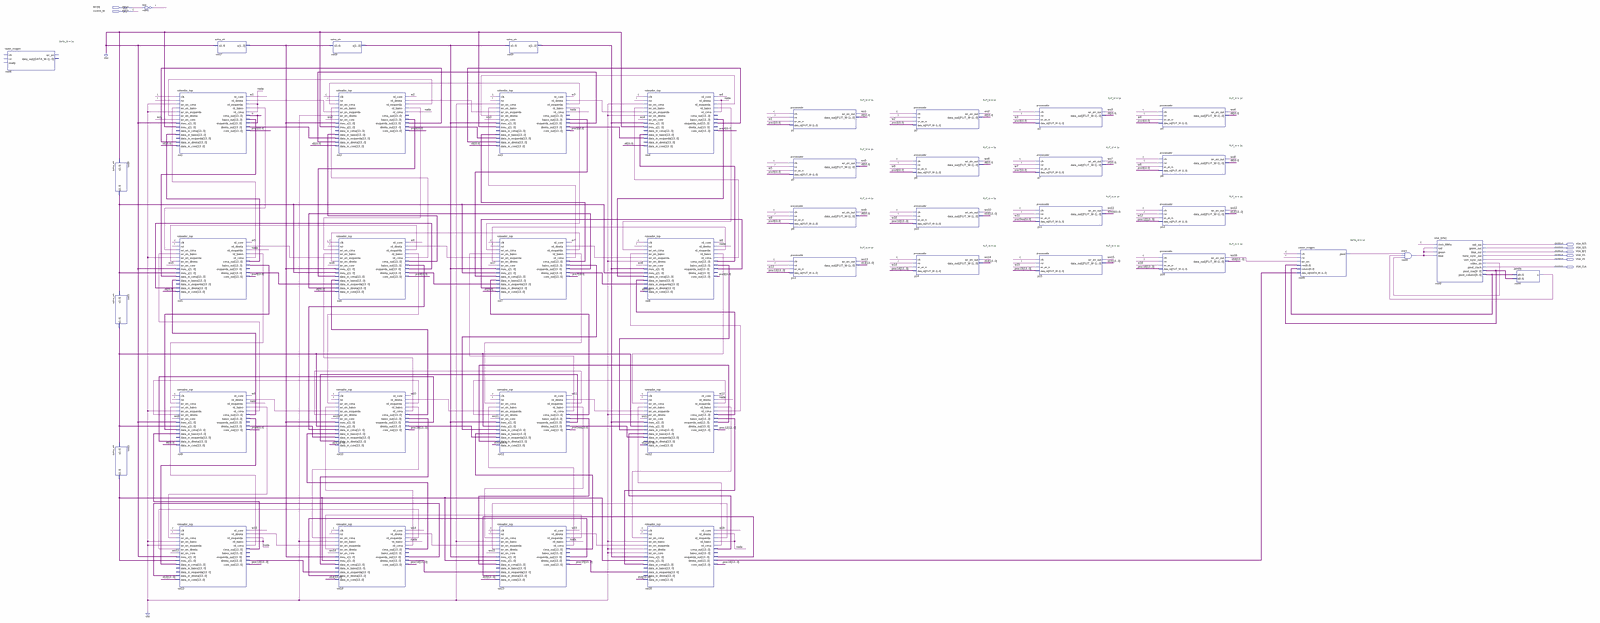
[diagram p0: schematic sheet, whole]
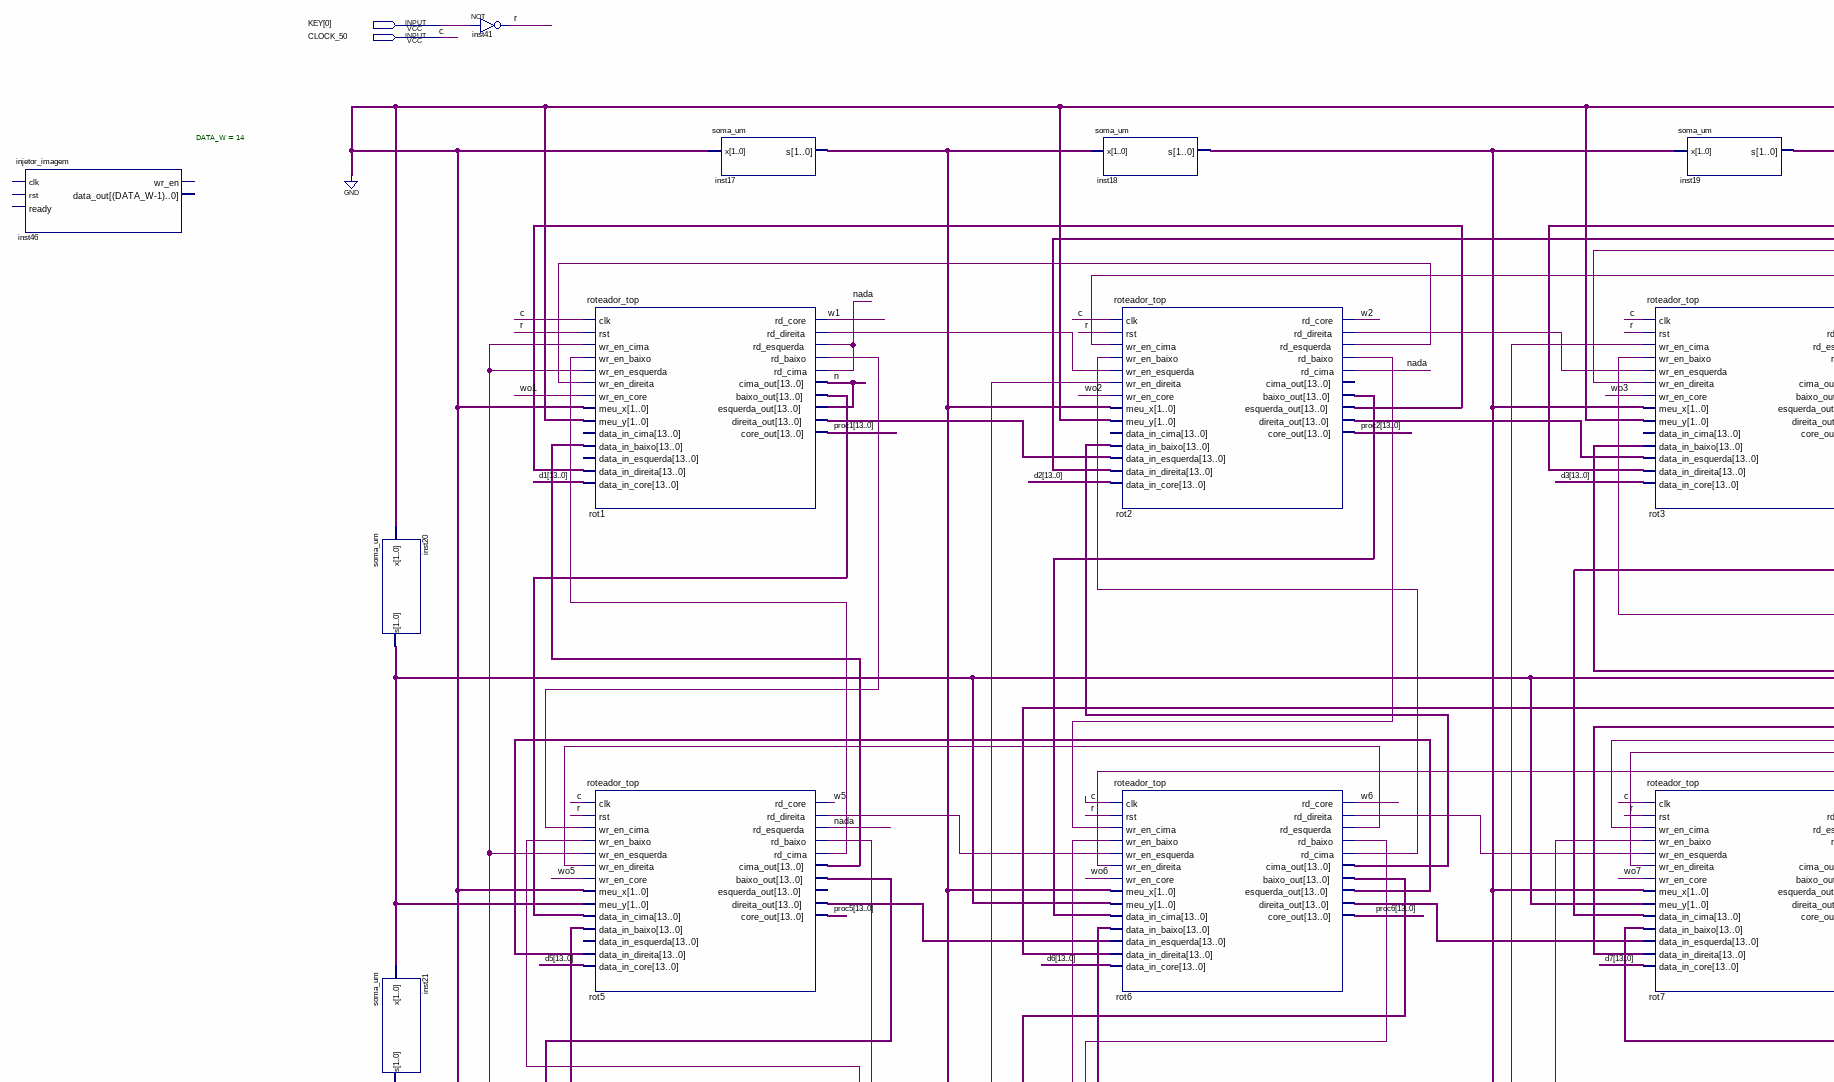
[diagram p1: schematic sheet, upper left part]
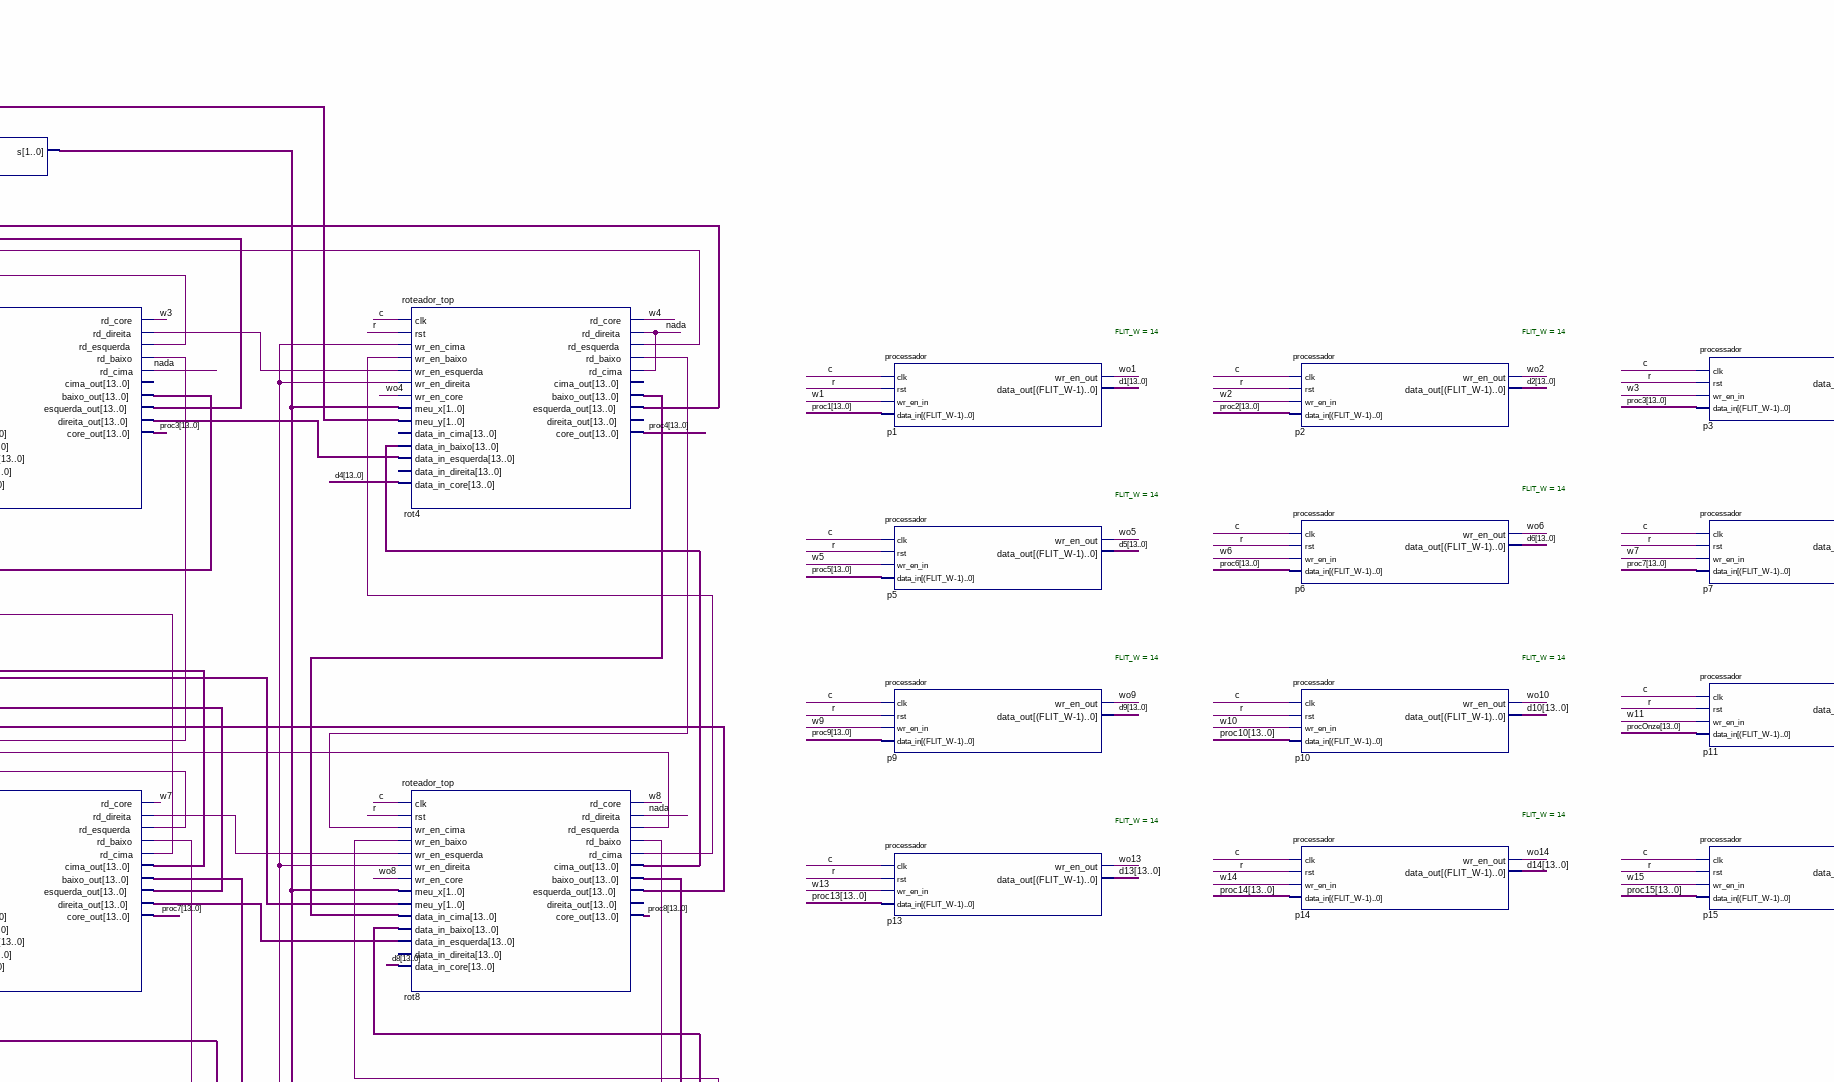
[diagram p2: schematic sheet, upper centre part]
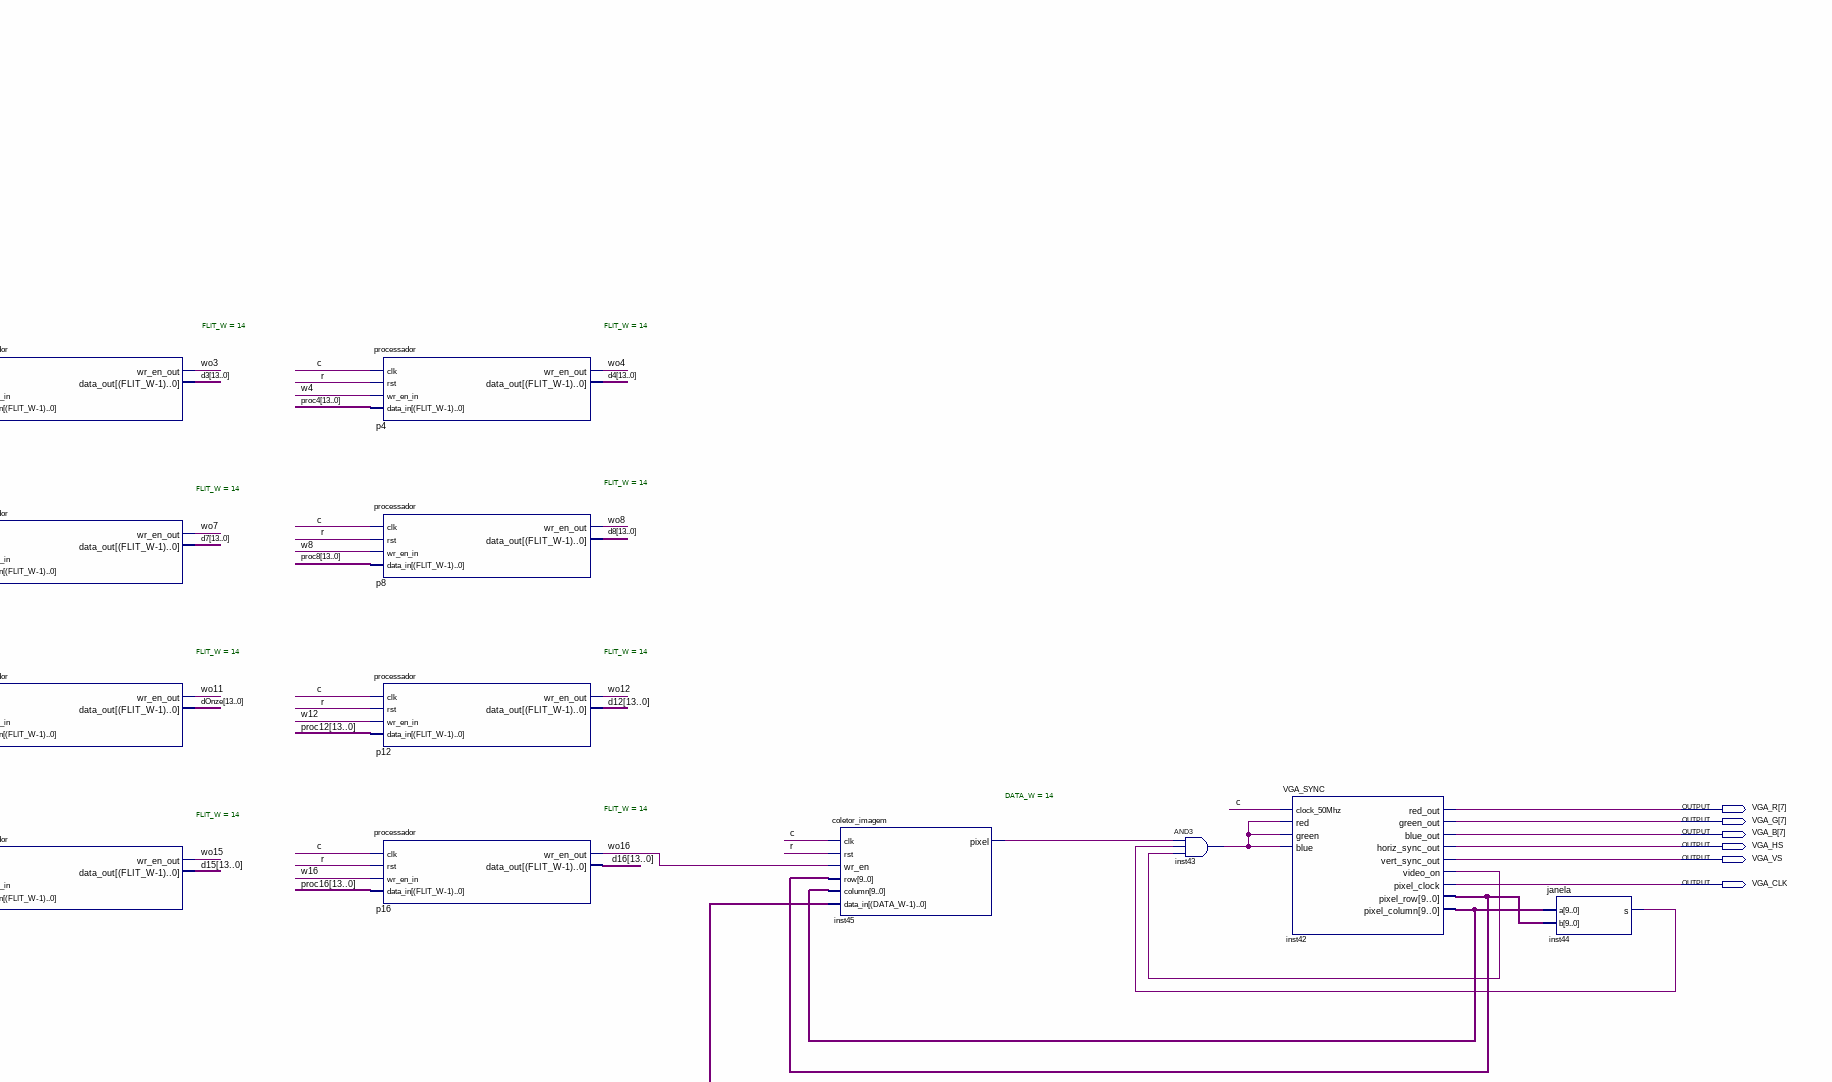
[diagram p3: schematic sheet, upper right part]
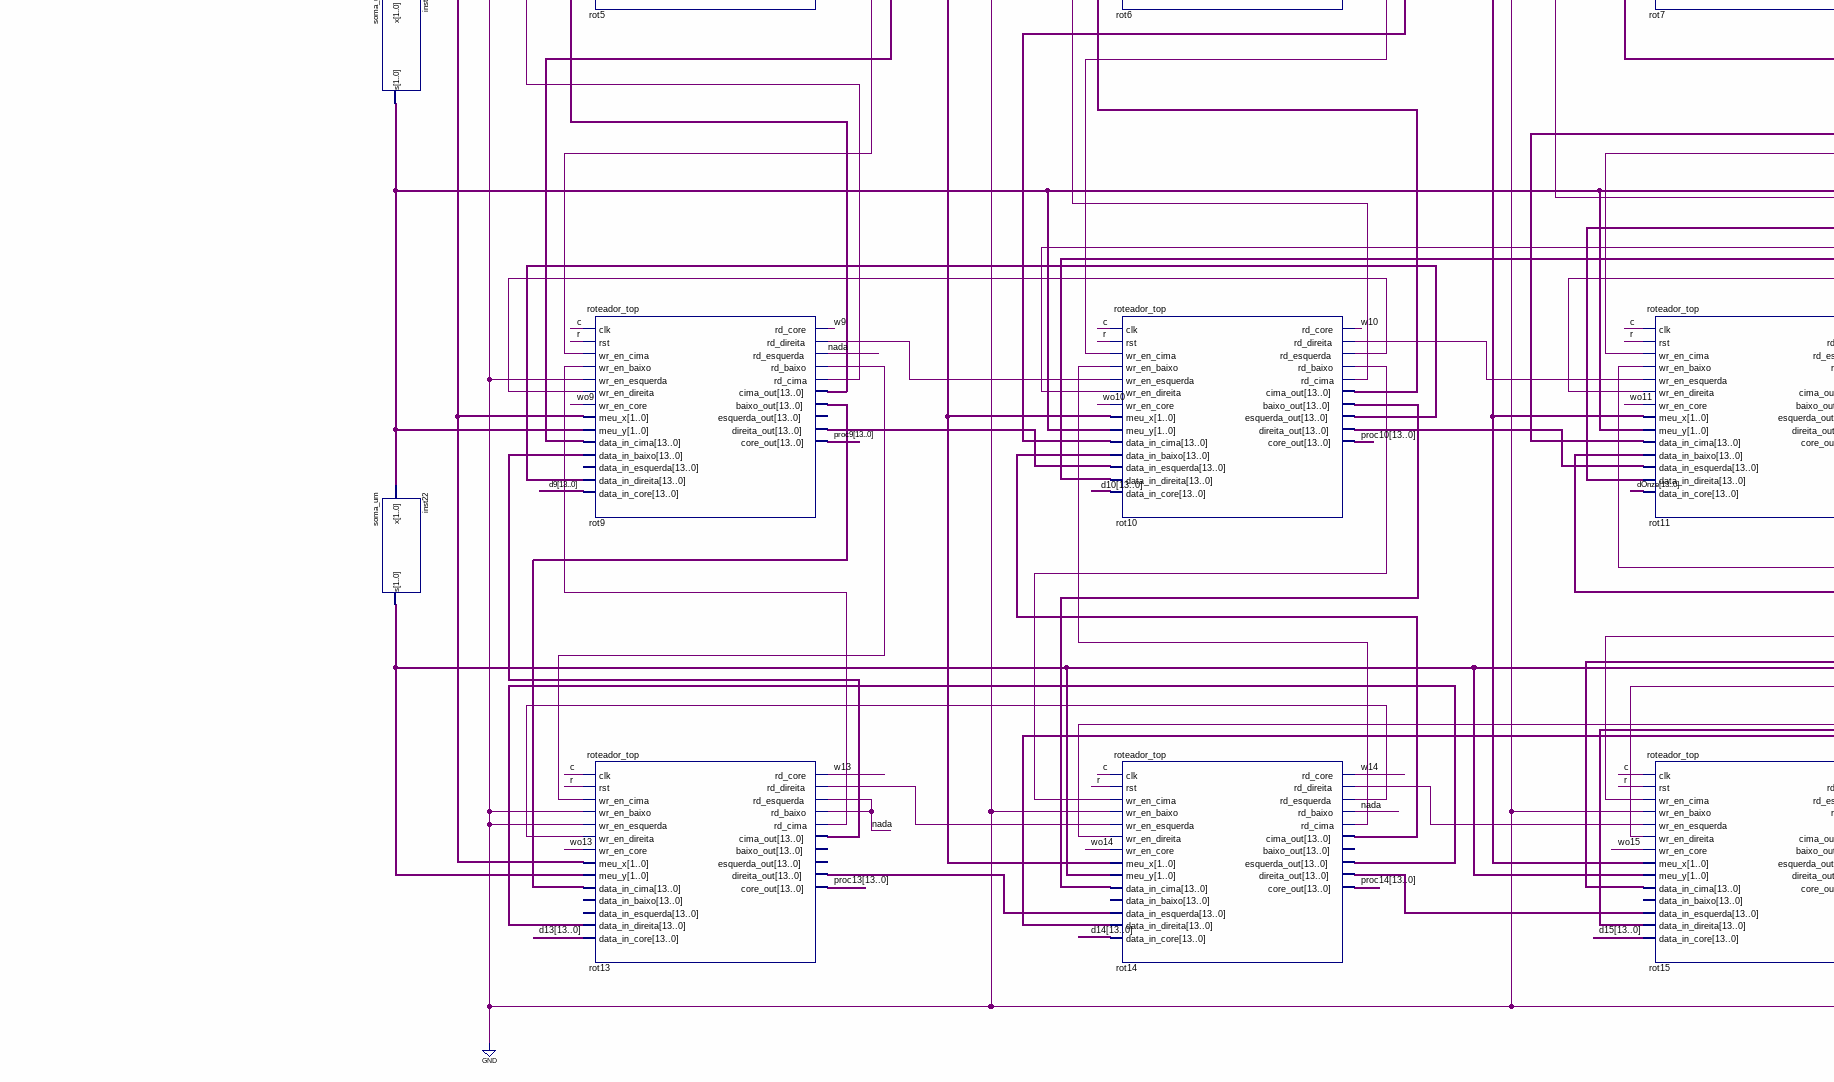
[diagram p4: schematic sheet, lower left part]
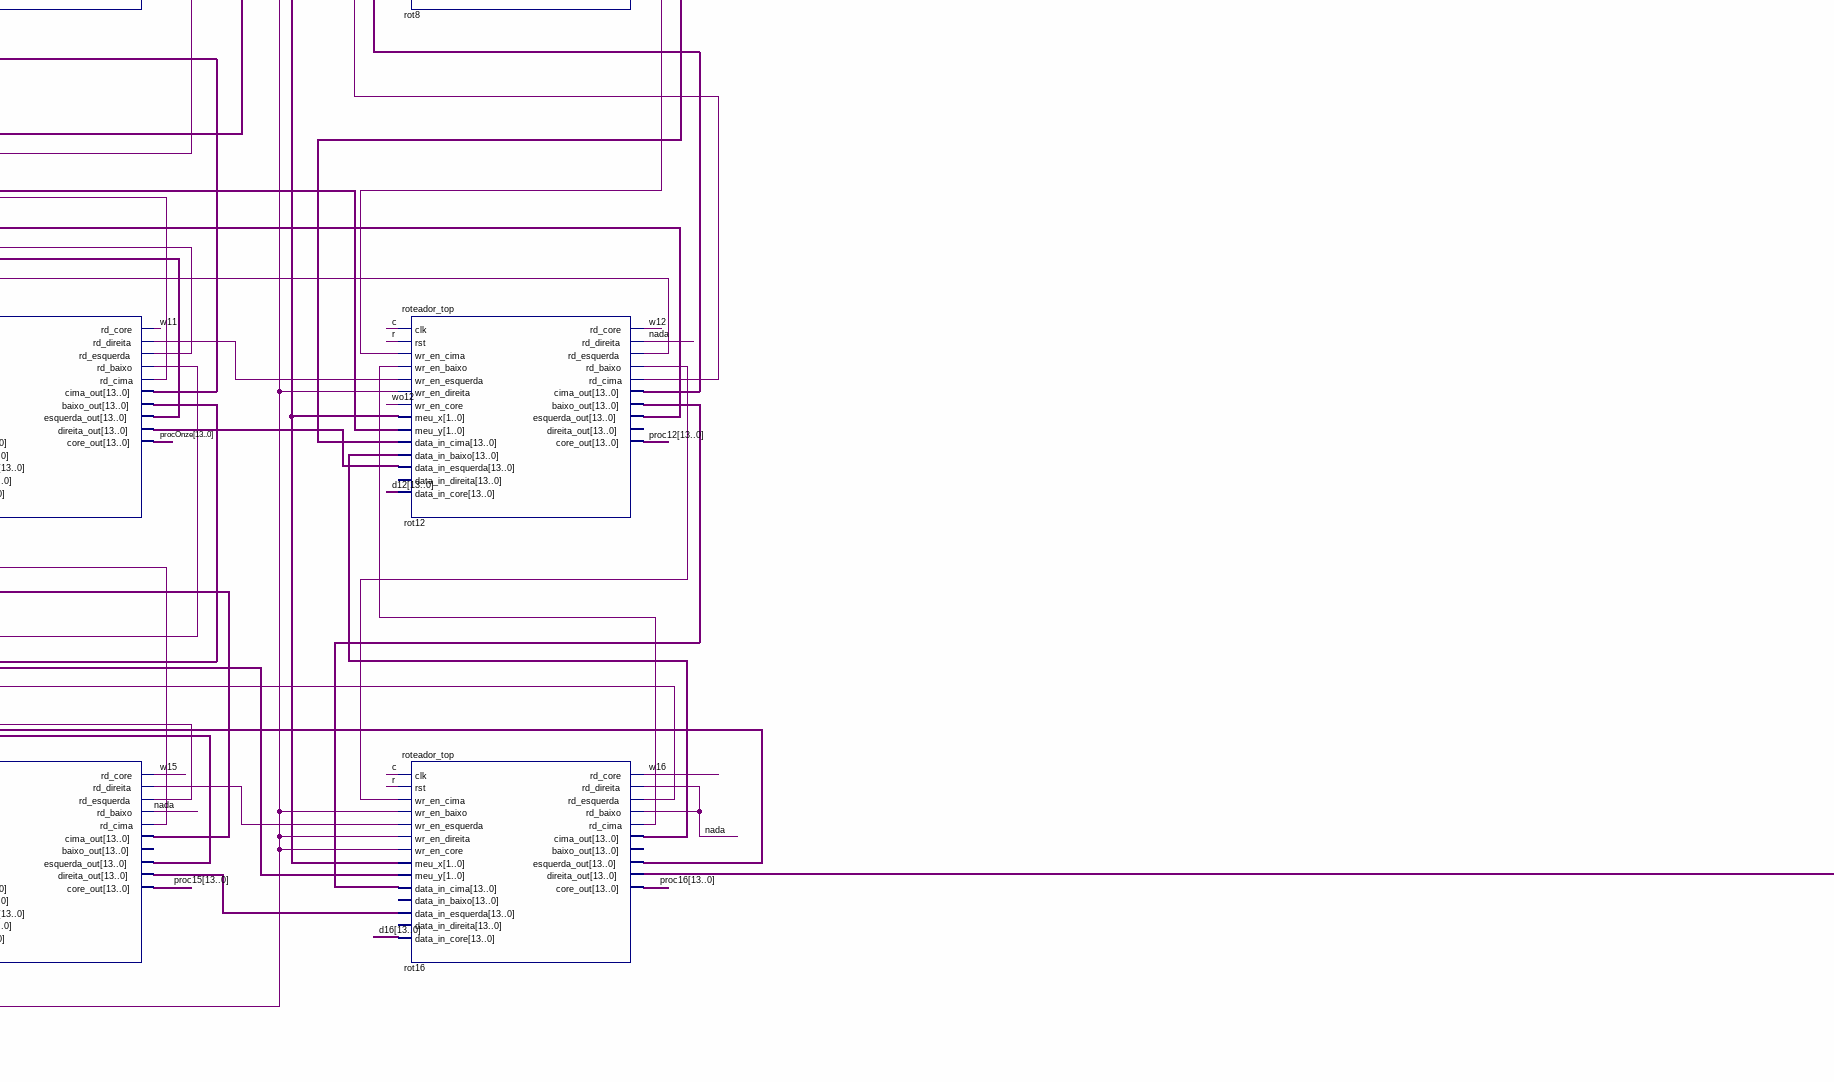
[diagram p5: schematic sheet, lower centre part]
// Quartus schematic trash.bdf as structural Verilog: 44 symbols, 8 pins
module trash (
  input  [0:0] KEY,
  input  CLOCK_50,
  output [7:7] VGA_R,
  output [7:7] VGA_G,
  output [7:7] VGA_B,
  output VGA_HS,
  output VGA_VS,
  output VGA_CLK
);

  wire inst42_video_on, inst43_out, inst44_s, inst45_pixel, n, nada, r, rot1_rd_baixo, rot1_rd_direita,
       rot2_rd_baixo, rot2_rd_direita, rot2_rd_esquerda, rot3_rd_baixo, rot3_rd_direita, rot3_rd_esquerda,
       rot4_rd_baixo, rot4_rd_esquerda, rot5_rd_baixo, rot5_rd_cima, rot5_rd_direita, rot6_rd_baixo,
       rot6_rd_cima, rot6_rd_direita, rot6_rd_esquerda, rot7_rd_baixo, rot7_rd_cima, rot7_rd_direita,
       rot7_rd_esquerda, rot8_rd_baixo, rot8_rd_cima, rot8_rd_esquerda, rot9_rd_baixo, rot9_rd_cima,
       rot9_rd_direita, rot10_rd_baixo, rot10_rd_cima, rot10_rd_direita, rot10_rd_esquerda, rot11_rd_baixo,
       rot11_rd_cima, rot11_rd_direita, rot11_rd_esquerda, rot12_rd_baixo, rot12_rd_cima, rot12_rd_esquerda,
       rot13_rd_cima, rot13_rd_direita, rot14_rd_cima, rot14_rd_direita, rot14_rd_esquerda, rot15_rd_cima,
       rot15_rd_direita, rot15_rd_esquerda, rot16_rd_cima, rot16_rd_esquerda, w1, w2, w3, w4, w5, w6, w7, w8,
       w9, w10, w11, w12, w13, w14, w15, w16, wo1, wo2, wo3, wo4, wo5, wo6, wo7, wo8, wo9, wo10, wo11, wo12,
       wo13, wo14, wo15, wo16;
  wire [1:0] inst17_s, inst18_s, inst19_s, inst20_s, inst21_s, inst22_s;
  wire [9:0] inst42_pixel_column, inst42_pixel_row;
  wire [13:0] d1, d2, d3, d4, d5, d6, d7, d8, d9, d10, d12, d13, d14, d15, d16, dOnze, proc1, proc2, proc3,
       proc4, proc5, proc6, proc7, proc8, proc9, proc10, proc12, proc13, proc14, proc15, proc16, procOnze,
       rot1_baixo_out, rot1_direita_out, rot2_baixo_out, rot2_direita_out, rot2_esquerda_out, rot3_baixo_out,
       rot3_direita_out, rot3_esquerda_out, rot4_baixo_out, rot4_esquerda_out, rot5_baixo_out, rot5_cima_out,
       rot5_direita_out, rot6_baixo_out, rot6_cima_out, rot6_direita_out, rot6_esquerda_out, rot7_baixo_out,
       rot7_cima_out, rot7_direita_out, rot7_esquerda_out, rot8_baixo_out, rot8_cima_out, rot8_esquerda_out,
       rot9_baixo_out, rot9_cima_out, rot9_direita_out, rot10_baixo_out, rot10_cima_out, rot10_direita_out,
       rot10_esquerda_out, rot11_baixo_out, rot11_cima_out, rot11_direita_out, rot11_esquerda_out,
       rot12_baixo_out, rot12_cima_out, rot12_esquerda_out, rot13_cima_out, rot13_direita_out,
       rot14_cima_out, rot14_direita_out, rot14_esquerda_out, rot15_cima_out, rot15_direita_out,
       rot15_esquerda_out, rot16_cima_out, rot16_direita_out, rot16_esquerda_out;

  injetor_imagem #(.DATA_W(14)) inst46 ();  // open: clk, rst, ready, wr_en, data_out
  soma_um inst20 (.x(2'b00), .s(inst20_s));
  soma_um inst21 (.x(inst20_s), .s(inst21_s));
  soma_um inst22 (.x(inst21_s), .s(inst22_s));
  not inst41 (r, KEY[0]);
  roteador_top rot1 (
    .clk(CLOCK_50), .rst(r), .wr_en_cima(1'b0), .wr_en_baixo(rot5_rd_cima), .wr_en_esquerda(1'b0),
    .wr_en_direita(rot2_rd_esquerda), .wr_en_core(wo1), .meu_x(2'b00), .meu_y(2'b00),
    .data_in_baixo(rot5_cima_out), .data_in_direita(rot2_esquerda_out), .data_in_core(d1), .rd_core(w1),
    .rd_direita(rot1_rd_direita), .rd_esquerda(nada), .rd_baixo(rot1_rd_baixo), .rd_cima(nada), .cima_out(n),
    .baixo_out(rot1_baixo_out), .esquerda_out(n), .direita_out(rot1_direita_out), .core_out(proc1));  // open: data_in_cima, data_in_esquerda
  roteador_top rot5 (
    .clk(CLOCK_50), .rst(r), .wr_en_cima(rot1_rd_baixo), .wr_en_baixo(rot9_rd_cima), .wr_en_esquerda(1'b0),
    .wr_en_direita(rot6_rd_esquerda), .wr_en_core(wo5), .meu_x(2'b00), .meu_y(inst20_s),
    .data_in_cima(rot1_baixo_out), .data_in_baixo(rot9_cima_out), .data_in_direita(rot6_esquerda_out),
    .data_in_core(d5), .rd_core(w5), .rd_direita(rot5_rd_direita), .rd_esquerda(nada),
    .rd_baixo(rot5_rd_baixo), .rd_cima(rot5_rd_cima), .cima_out(rot5_cima_out), .baixo_out(rot5_baixo_out),
    .direita_out(rot5_direita_out), .core_out(proc5));  // open: data_in_esquerda, esquerda_out
  roteador_top rot9 (
    .clk(CLOCK_50), .rst(r), .wr_en_cima(rot5_rd_baixo), .wr_en_baixo(rot13_rd_cima), .wr_en_esquerda(1'b0),
    .wr_en_direita(rot10_rd_esquerda), .wr_en_core(wo9), .meu_x(2'b00), .meu_y(inst21_s),
    .data_in_cima(rot5_baixo_out), .data_in_baixo(rot13_cima_out), .data_in_direita(rot10_esquerda_out),
    .data_in_core(d9), .rd_core(w9), .rd_direita(rot9_rd_direita), .rd_esquerda(nada),
    .rd_baixo(rot9_rd_baixo), .rd_cima(rot9_rd_cima), .cima_out(rot9_cima_out), .baixo_out(rot9_baixo_out),
    .direita_out(rot9_direita_out), .core_out(proc9));  // open: data_in_esquerda, esquerda_out
  roteador_top rot13 (
    .clk(CLOCK_50), .rst(r), .wr_en_cima(rot9_rd_baixo), .wr_en_baixo(1'b0), .wr_en_esquerda(1'b0),
    .wr_en_direita(rot14_rd_esquerda), .wr_en_core(wo13), .meu_x(2'b00), .meu_y(inst22_s),
    .data_in_cima(rot9_baixo_out), .data_in_direita(rot14_esquerda_out), .data_in_core(d13), .rd_core(w13),
    .rd_direita(rot13_rd_direita), .rd_esquerda(nada), .rd_baixo(nada), .rd_cima(rot13_rd_cima),
    .cima_out(rot13_cima_out), .direita_out(rot13_direita_out), .core_out(proc13));  // open: data_in_baixo, data_in_esquerda, baixo_out, esquerda_out
  soma_um inst17 (.x(2'b00), .s(inst17_s));
  soma_um inst18 (.x(inst17_s), .s(inst18_s));
  roteador_top rot2 (
    .clk(CLOCK_50), .rst(r), .wr_en_cima(rot3_rd_esquerda), .wr_en_baixo(rot6_rd_cima),
    .wr_en_esquerda(rot1_rd_direita), .wr_en_direita(1'b0), .wr_en_core(wo2), .meu_x(inst17_s),
    .meu_y(2'b00), .data_in_baixo(rot6_cima_out), .data_in_esquerda(rot1_direita_out),
    .data_in_direita(rot3_esquerda_out), .data_in_core(d2), .rd_core(w2), .rd_direita(rot2_rd_direita),
    .rd_esquerda(rot2_rd_esquerda), .rd_baixo(rot2_rd_baixo), .rd_cima(nada), .baixo_out(rot2_baixo_out),
    .esquerda_out(rot2_esquerda_out), .direita_out(rot2_direita_out), .core_out(proc2));  // open: data_in_cima, cima_out
  roteador_top rot6 (
    .clk(CLOCK_50), .rst(r), .wr_en_cima(rot2_rd_baixo), .wr_en_baixo(rot10_rd_cima),
    .wr_en_esquerda(rot5_rd_direita), .wr_en_direita(rot7_rd_esquerda), .wr_en_core(wo6), .meu_x(inst17_s),
    .meu_y(inst20_s), .data_in_cima(rot2_baixo_out), .data_in_baixo(rot10_cima_out),
    .data_in_esquerda(rot5_direita_out), .data_in_direita(rot7_esquerda_out), .data_in_core(d6),
    .rd_core(w6), .rd_direita(rot6_rd_direita), .rd_esquerda(rot6_rd_esquerda), .rd_baixo(rot6_rd_baixo),
    .rd_cima(rot6_rd_cima), .cima_out(rot6_cima_out), .baixo_out(rot6_baixo_out),
    .esquerda_out(rot6_esquerda_out), .direita_out(rot6_direita_out), .core_out(proc6));
  roteador_top rot10 (
    .clk(CLOCK_50), .rst(r), .wr_en_cima(rot6_rd_baixo), .wr_en_baixo(rot14_rd_cima),
    .wr_en_esquerda(rot9_rd_direita), .wr_en_direita(rot11_rd_esquerda), .wr_en_core(wo10), .meu_x(inst17_s),
    .meu_y(inst21_s), .data_in_cima(rot6_baixo_out), .data_in_baixo(rot14_cima_out),
    .data_in_esquerda(rot9_direita_out), .data_in_direita(rot11_esquerda_out), .data_in_core(d10),
    .rd_core(w10), .rd_direita(rot10_rd_direita), .rd_esquerda(rot10_rd_esquerda), .rd_baixo(rot10_rd_baixo),
    .rd_cima(rot10_rd_cima), .cima_out(rot10_cima_out), .baixo_out(rot10_baixo_out),
    .esquerda_out(rot10_esquerda_out), .direita_out(rot10_direita_out), .core_out(proc10));
  roteador_top rot14 (
    .clk(CLOCK_50), .rst(r), .wr_en_cima(rot10_rd_baixo), .wr_en_baixo(1'b0),
    .wr_en_esquerda(rot13_rd_direita), .wr_en_direita(rot15_rd_esquerda), .wr_en_core(wo14),
    .meu_x(inst17_s), .meu_y(inst22_s), .data_in_cima(rot10_baixo_out), .data_in_esquerda(rot13_direita_out),
    .data_in_direita(rot15_esquerda_out), .data_in_core(d14), .rd_core(w14), .rd_direita(rot14_rd_direita),
    .rd_esquerda(rot14_rd_esquerda), .rd_baixo(nada), .rd_cima(rot14_rd_cima), .cima_out(rot14_cima_out),
    .esquerda_out(rot14_esquerda_out), .direita_out(rot14_direita_out), .core_out(proc14));  // open: data_in_baixo, baixo_out
  soma_um inst19 (.x(inst18_s), .s(inst19_s));
  roteador_top rot3 (
    .clk(CLOCK_50), .rst(r), .wr_en_cima(1'b0), .wr_en_baixo(rot7_rd_cima), .wr_en_esquerda(rot2_rd_direita),
    .wr_en_direita(rot4_rd_esquerda), .wr_en_core(wo3), .meu_x(inst18_s), .meu_y(2'b00),
    .data_in_baixo(rot7_cima_out), .data_in_esquerda(rot2_direita_out), .data_in_direita(rot4_esquerda_out),
    .data_in_core(d3), .rd_core(w3), .rd_direita(rot3_rd_direita), .rd_esquerda(rot3_rd_esquerda),
    .rd_baixo(rot3_rd_baixo), .rd_cima(nada), .baixo_out(rot3_baixo_out), .esquerda_out(rot3_esquerda_out),
    .direita_out(rot3_direita_out), .core_out(proc3));  // open: data_in_cima, cima_out
  roteador_top rot7 (
    .clk(CLOCK_50), .rst(r), .wr_en_cima(rot3_rd_baixo), .wr_en_baixo(rot11_rd_cima),
    .wr_en_esquerda(rot6_rd_direita), .wr_en_direita(rot8_rd_esquerda), .wr_en_core(wo7), .meu_x(inst18_s),
    .meu_y(inst20_s), .data_in_cima(rot3_baixo_out), .data_in_baixo(rot11_cima_out),
    .data_in_esquerda(rot6_direita_out), .data_in_direita(rot8_esquerda_out), .data_in_core(d7),
    .rd_core(w7), .rd_direita(rot7_rd_direita), .rd_esquerda(rot7_rd_esquerda), .rd_baixo(rot7_rd_baixo),
    .rd_cima(rot7_rd_cima), .cima_out(rot7_cima_out), .baixo_out(rot7_baixo_out),
    .esquerda_out(rot7_esquerda_out), .direita_out(rot7_direita_out), .core_out(proc7));
  roteador_top rot11 (
    .clk(CLOCK_50), .rst(r), .wr_en_cima(rot7_rd_baixo), .wr_en_baixo(rot15_rd_cima),
    .wr_en_esquerda(rot10_rd_direita), .wr_en_direita(rot12_rd_esquerda), .wr_en_core(wo11),
    .meu_x(inst18_s), .meu_y(inst21_s), .data_in_cima(rot7_baixo_out), .data_in_baixo(rot15_cima_out),
    .data_in_esquerda(rot10_direita_out), .data_in_direita(rot12_esquerda_out), .data_in_core(dOnze),
    .rd_core(w11), .rd_direita(rot11_rd_direita), .rd_esquerda(rot11_rd_esquerda), .rd_baixo(rot11_rd_baixo),
    .rd_cima(rot11_rd_cima), .cima_out(rot11_cima_out), .baixo_out(rot11_baixo_out),
    .esquerda_out(rot11_esquerda_out), .direita_out(rot11_direita_out), .core_out(procOnze));
  roteador_top rot15 (
    .clk(CLOCK_50), .rst(r), .wr_en_cima(rot11_rd_baixo), .wr_en_baixo(1'b0),
    .wr_en_esquerda(rot14_rd_direita), .wr_en_direita(rot16_rd_esquerda), .wr_en_core(wo15),
    .meu_x(inst18_s), .meu_y(inst22_s), .data_in_cima(rot11_baixo_out), .data_in_esquerda(rot14_direita_out),
    .data_in_direita(rot16_esquerda_out), .data_in_core(d15), .rd_core(w15), .rd_direita(rot15_rd_direita),
    .rd_esquerda(rot15_rd_esquerda), .rd_baixo(nada), .rd_cima(rot15_rd_cima), .cima_out(rot15_cima_out),
    .esquerda_out(rot15_esquerda_out), .direita_out(rot15_direita_out), .core_out(proc15));  // open: data_in_baixo, baixo_out
  roteador_top rot4 (
    .clk(CLOCK_50), .rst(r), .wr_en_cima(1'b0), .wr_en_baixo(rot8_rd_cima), .wr_en_esquerda(rot3_rd_direita),
    .wr_en_direita(1'b0), .wr_en_core(wo4), .meu_x(inst19_s), .meu_y(2'b00), .data_in_baixo(rot8_cima_out),
    .data_in_esquerda(rot3_direita_out), .data_in_core(d4), .rd_core(w4), .rd_direita(nada),
    .rd_esquerda(rot4_rd_esquerda), .rd_baixo(rot4_rd_baixo), .rd_cima(nada), .baixo_out(rot4_baixo_out),
    .esquerda_out(rot4_esquerda_out), .core_out(proc4));  // open: data_in_cima, data_in_direita, cima_out, direita_out
  roteador_top rot8 (
    .clk(CLOCK_50), .rst(r), .wr_en_cima(rot4_rd_baixo), .wr_en_baixo(rot12_rd_cima),
    .wr_en_esquerda(rot7_rd_direita), .wr_en_direita(1'b0), .wr_en_core(wo8), .meu_x(inst19_s),
    .meu_y(inst20_s), .data_in_cima(rot4_baixo_out), .data_in_baixo(rot12_cima_out),
    .data_in_esquerda(rot7_direita_out), .data_in_core(d8), .rd_core(w8), .rd_direita(nada),
    .rd_esquerda(rot8_rd_esquerda), .rd_baixo(rot8_rd_baixo), .rd_cima(rot8_rd_cima),
    .cima_out(rot8_cima_out), .baixo_out(rot8_baixo_out), .esquerda_out(rot8_esquerda_out), .core_out(proc8));  // open: data_in_direita, direita_out
  roteador_top rot12 (
    .clk(CLOCK_50), .rst(r), .wr_en_cima(rot8_rd_baixo), .wr_en_baixo(rot16_rd_cima),
    .wr_en_esquerda(rot11_rd_direita), .wr_en_direita(1'b0), .wr_en_core(wo12), .meu_x(inst19_s),
    .meu_y(inst21_s), .data_in_cima(rot8_baixo_out), .data_in_baixo(rot16_cima_out),
    .data_in_esquerda(rot11_direita_out), .data_in_core(d12), .rd_core(w12), .rd_direita(nada),
    .rd_esquerda(rot12_rd_esquerda), .rd_baixo(rot12_rd_baixo), .rd_cima(rot12_rd_cima),
    .cima_out(rot12_cima_out), .baixo_out(rot12_baixo_out), .esquerda_out(rot12_esquerda_out),
    .core_out(proc12));  // open: data_in_direita, direita_out
  roteador_top rot16 (
    .clk(CLOCK_50), .rst(r), .wr_en_cima(rot12_rd_baixo), .wr_en_baixo(1'b0),
    .wr_en_esquerda(rot15_rd_direita), .wr_en_direita(1'b0), .wr_en_core(1'b0), .meu_x(inst19_s),
    .meu_y(inst22_s), .data_in_cima(rot12_baixo_out), .data_in_esquerda(rot15_direita_out),
    .data_in_core(d16), .rd_core(w16), .rd_direita(nada), .rd_esquerda(rot16_rd_esquerda), .rd_baixo(nada),
    .rd_cima(rot16_rd_cima), .cima_out(rot16_cima_out), .esquerda_out(rot16_esquerda_out),
    .direita_out(rot16_direita_out), .core_out(proc16));  // open: data_in_baixo, data_in_direita, baixo_out
  processador #(.FLIT_W(14)) p1 (
    .clk(CLOCK_50), .rst(r), .wr_en_in(w1), .data_in(proc1), .wr_en_out(wo1), .data_out(d1));
  processador #(.FLIT_W(14)) p5 (
    .clk(CLOCK_50), .rst(r), .wr_en_in(w5), .data_in(proc5), .wr_en_out(wo5), .data_out(d5));
  processador #(.FLIT_W(14)) p9 (
    .clk(CLOCK_50), .rst(r), .wr_en_in(w9), .data_in(proc9), .wr_en_out(wo9), .data_out(d9));
  processador #(.FLIT_W(14)) p13 (
    .clk(CLOCK_50), .rst(r), .wr_en_in(w13), .data_in(proc13), .wr_en_out(wo13), .data_out(d13));
  processador #(.FLIT_W(14)) p2 (
    .clk(CLOCK_50), .rst(r), .wr_en_in(w2), .data_in(proc2), .wr_en_out(wo2), .data_out(d2));
  processador #(.FLIT_W(14)) p6 (
    .clk(CLOCK_50), .rst(r), .wr_en_in(w6), .data_in(proc6), .wr_en_out(wo6), .data_out(d6));
  processador #(.FLIT_W(14)) p10 (
    .clk(CLOCK_50), .rst(r), .wr_en_in(w10), .data_in(proc10), .wr_en_out(wo10), .data_out(d10));
  processador #(.FLIT_W(14)) p14 (
    .clk(CLOCK_50), .rst(r), .wr_en_in(w14), .data_in(proc14), .wr_en_out(wo14), .data_out(d14));
  processador #(.FLIT_W(14)) p3 (
    .clk(CLOCK_50), .rst(r), .wr_en_in(w3), .data_in(proc3), .wr_en_out(wo3), .data_out(d3));
  processador #(.FLIT_W(14)) p7 (
    .clk(CLOCK_50), .rst(r), .wr_en_in(w7), .data_in(proc7), .wr_en_out(wo7), .data_out(d7));
  processador #(.FLIT_W(14)) p11 (
    .clk(CLOCK_50), .rst(r), .wr_en_in(w11), .data_in(procOnze), .wr_en_out(wo11), .data_out(dOnze));
  processador #(.FLIT_W(14)) p15 (
    .clk(CLOCK_50), .rst(r), .wr_en_in(w15), .data_in(proc15), .wr_en_out(wo15), .data_out(d15));
  processador #(.FLIT_W(14)) p4 (
    .clk(CLOCK_50), .rst(r), .wr_en_in(w4), .data_in(proc4), .wr_en_out(wo4), .data_out(d4));
  processador #(.FLIT_W(14)) p8 (
    .clk(CLOCK_50), .rst(r), .wr_en_in(w8), .data_in(proc8), .wr_en_out(wo8), .data_out(d8));
  processador #(.FLIT_W(14)) p12 (
    .clk(CLOCK_50), .rst(r), .wr_en_in(w12), .data_in(proc12), .wr_en_out(wo12), .data_out(d12));
  processador #(.FLIT_W(14)) p16 (
    .clk(CLOCK_50), .rst(r), .wr_en_in(w16), .data_in(proc16), .wr_en_out(wo16), .data_out(d16));
  coletor_imagem #(.DATA_W(14)) inst45 (
    .clk(CLOCK_50), .rst(r), .wr_en(wo16), .row(inst42_pixel_row), .column(inst42_pixel_column),
    .data_in(rot16_direita_out), .pixel(inst45_pixel));
  and inst43 (inst43_out, inst45_pixel, inst44_s, inst42_video_on);
  VGA_SYNC inst42 (
    .clock_50Mhz(CLOCK_50), .red(inst43_out), .green(inst43_out), .blue(inst43_out), .red_out(VGA_R[7]),
    .green_out(VGA_G[7]), .blue_out(VGA_B[7]), .horiz_sync_out(VGA_HS), .vert_sync_out(VGA_VS),
    .video_on(inst42_video_on), .pixel_clock(VGA_CLK), .pixel_row(inst42_pixel_row),
    .pixel_column(inst42_pixel_column));
  janela inst44 (.a(inst42_pixel_column), .b(inst42_pixel_row), .s(inst44_s));

  // Other names for the same wires on the sheet: c = CLOCK_50
endmodule
